# Altium schematic sheet Encoder.SchDoc
size B
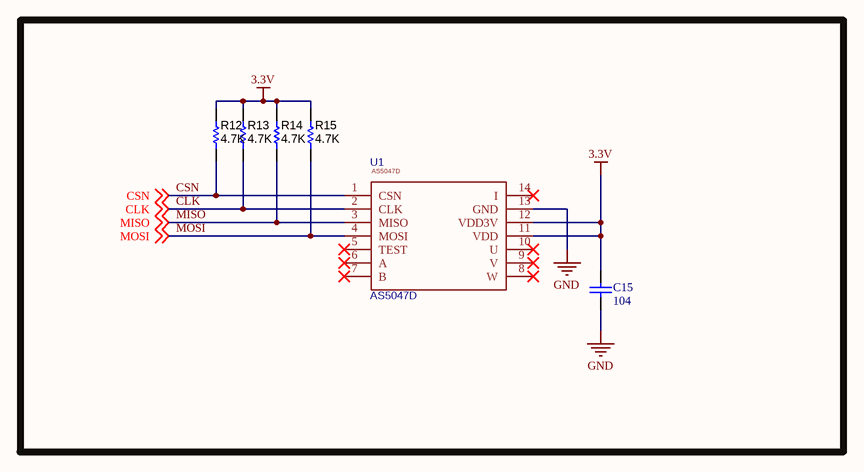
[diagram p0: Encoder.SchDoc]

## Parts
C15  104  [TU_SMD_0805]
R12  4.7K  [0805_HV]
R13  4.7K  [0805_HV]
R14  4.7K  [0805_HV]
R15  4.7K  [0805_HV]
U1  AS5047D  [TSSOP14]

## Nets
3.3V: C15.2 R12.2 R13.2 R14.2 R15.2 U1.11(VDD) U1.12(VDD3V)
GND: C15.1 U1.13(GND)
CLK: R13.1 U1.2(CLK) ; off-sheet CLK
CSN: R12.1 U1.1(CSN) ; off-sheet CSN
MISO: R14.1 U1.3(MISO) ; off-sheet MISO
MOSI: R15.1 U1.4(MOSI) ; off-sheet MOSI

Not connected (* = marked no-connect by the designer): U1 5(TEST)* 6(A)* 7(B)* 8(W)* 9(V)* 10(U)* 14(I)*

## Library data of the parts
C15 = TU_SMD_0805_MH
R12-R15 = R nho: RES, 100, 1%, 0.1 W, 0402; PartNumber: ERJ-2RKF1000X; Manufacturer: Panasonic; CompType: Resistor; Res_ohm: 100; Value_Code: 100R; Tolerance_%: 1; Power_W: 0.1; Value2: 0.1W; VDC_V: 50; TempCo: 100 ppm/C; EIA_Code: E96; U/M: EA; AEC Category: Q200; Value: 4.7K; SymbolVersion: 2009-05-29; PackageReference: 0402; RoHS: Y; Value1: 1%; MountType: SMT; Technology: Thick Film; Published: 2008-06-26; Publisher: Texas Instruments; LatestRevisionDate: 2016-01-08; ComponentLink1Description: Datasheet link; ComponentLink1URL: http://industrial.panasonic.com/www-data/pdf/AOA0000/AOA0000CE2.pdf; Supplier 1: Digi-Key; Supplier Part Number 1: P100LCT-ND; Supplier 2: Mouser; Supplier Part Number 2: 667-ERJ-2RKF1000X; Supplier 3: Farnell; Supplier Part Number 3: 2304034; AEC Qualified: ?
U1 = AS5047D: BOM_Manufacturer Part: ?; spicePre: U; Supplier 1: Digi-Key; Supplier Part Number 1: AS5047D-ATSMTR-ND